# EAGLE design 7-seg_x_8-digRev2 (EAGLE 6.6.0)
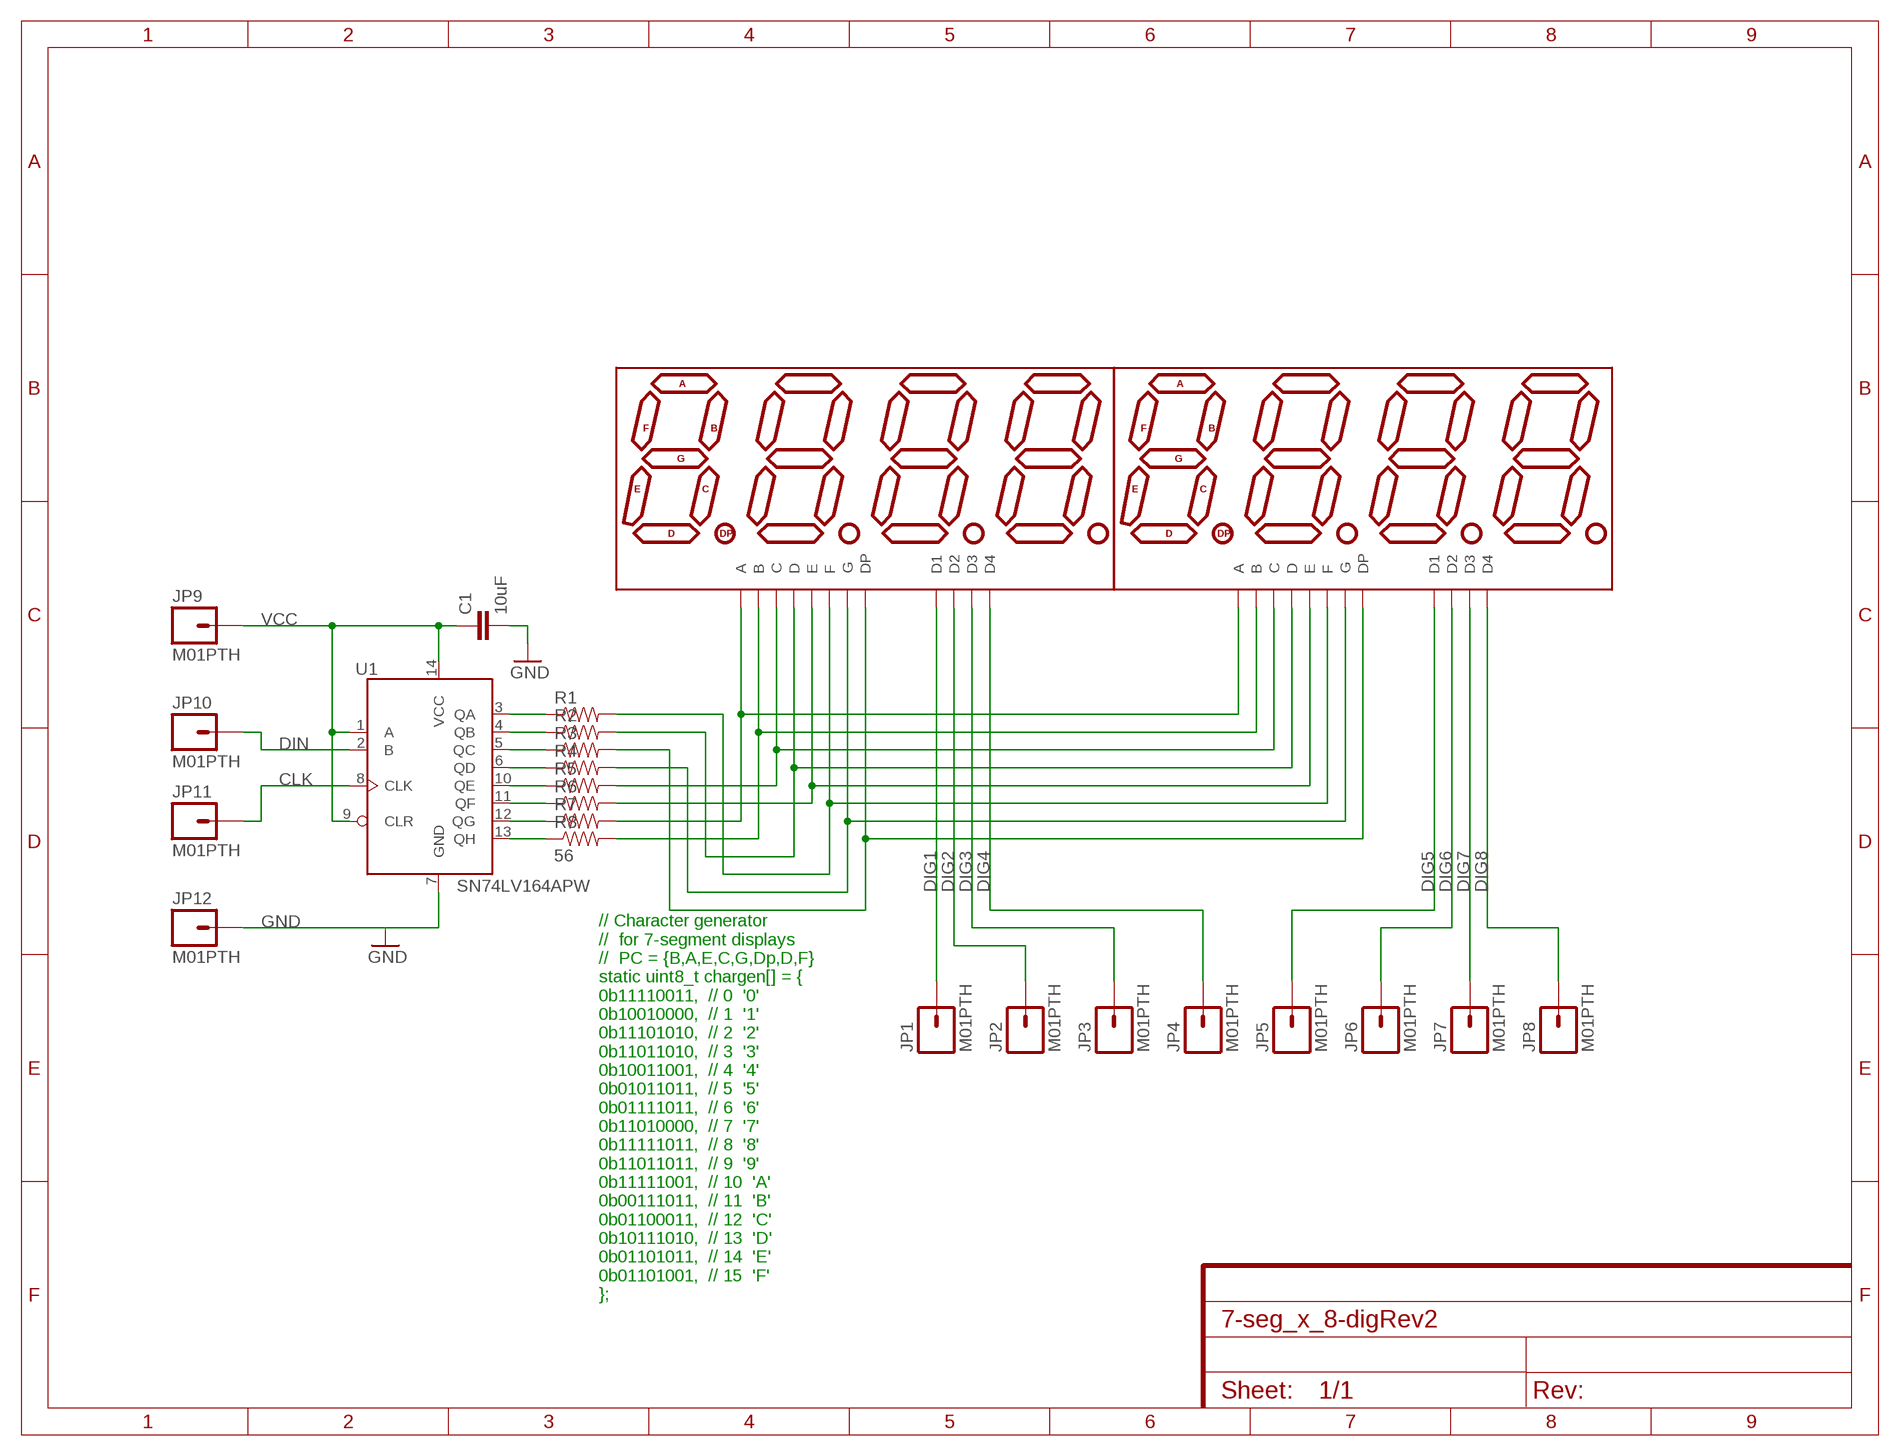
[diagram p0: schematic, sheet 1]

## Parts
C1  10uF  CAP0805  [0805]
FRAME1  FRAME_LTR_CU_MARK  [FR-LTR-ON-PCB]
JP1  M01PTH  [1X01]
JP2  M01PTH  [1X01]
JP3  M01PTH  [1X01]
JP4  M01PTH  [1X01]
JP5  M01PTH  [1X01]
JP6  M01PTH  [1X01]
JP7  M01PTH  [1X01]
JP8  M01PTH  [1X01]
JP9  M01PTH  [1X01]
JP10  M01PTH  [1X01]
JP11  M01PTH  [1X01]
JP12  M01PTH  [1X01]
R1  RESISTOR0805-RES  [0805]
R2  RESISTOR0805-RES  [0805]
R3  RESISTOR0805-RES  [0805]
R4  RESISTOR0805-RES  [0805]
R5  RESISTOR0805-RES  [0805]
R6  RESISTOR0805-RES  [0805]
R7  RESISTOR0805-RES  [0805]
R8  56  RESISTOR0805-RES  [0805]
U1  SN74LV164APW  [TSSOP-14(TI)]
U$1  HP_DISPLAY  [DIL12]
U$2  HP_DISPLAY  [DIL12]

## Nets
CLK: JP11.1 U1.8(CLK)
DIG1: JP1.1 U$1.1(D1)
DIG2: JP2.1 U$1.10(D2)
DIG3: JP3.1 U$1.4(D3)
DIG4: JP4.1 U$1.6(D4)
DIG5: JP5.1 U$2.1(D1)
DIG6: JP6.1 U$2.10(D2)
DIG7: JP7.1 U$2.4(D3)
DIG8: JP8.1 U$2.6(D4)
DIN: JP10.1 U1.2(B)
GND: C1.2 JP12.1 U1.7(GND)
N$1: R1.1 U1.3(QA)
N$2: R2.1 U1.4(QB)
N$3: R3.1 U1.5(QC)
N$4: R4.1 U1.6(QD)
N$5: R5.1 U1.10(QE)
N$6: R6.1 U1.11(QF)
N$7: R7.1 U1.12(QG)
N$8: R8.1 U1.13(QH)
SEGA: R7.2 U$1.12(A) U$2.12(A)
SEGB: R8.2 U$1.11(B) U$2.11(B)
SEGC: R5.2 U$1.3(C) U$2.3(C)
SEGD: R2.2 U$1.8(D) U$2.8(D)
SEGDP: R3.2 U$1.5(DP) U$2.5(DP)
SEGE: R6.2 U$1.2(E) U$2.2(E)
SEGF: R1.2 U$1.9(F) U$2.9(F)
SEGG: R4.2 U$1.7(G) U$2.7(G)
VCC: C1.1 JP9.1 U1.1(A) U1.9(CLR) U1.14(VCC)

## Notes on the sheet
- // Character generator
  //  for 7-segment displays
  //  PC = {B,A,E,C,G,Dp,D,F}
  static uint8_t chargen[] = {
  0b11110011,  // 0  '0'
  0b10010000,  // 1  '1'
  0b11101010,  // 2  '2'
  0b11011010,  // 3  '3'
  0b10011001,  // 4  '4'
  0b01011011,  // 5  '5'
  0b01111011,  // 6  '6'
  0b11010000,  // 7  '7'
  0b11111011,  // 8  '8'
  0b11011011,  // 9  '9'
  0b11111001,  // 10  'A'
  0b00111011,  // 11  'B'
  0b01100011,  // 12  'C'
  0b10111010,  // 13  'D'
  0b01101011,  // 14  'E'
  0b01101001,  // 15  'F'
  };

## Library data of the parts
C1 = SparkFun-Capacitors:CAP: Capacitor Standard 0603 ceramic capacitor, and 0.1" leaded capacitor.
FRAME1 = NewFrame:FRAME_LTR_CU_MARK: This frame is sized for an 8.5x11" page with a 0.25" margin. It also places a name, datecode and revision mark in the bottom copper layer of the PCB.; CNAME: C.Schnarel; CREVISION: Rev 2; DATECODE: 13OCT2014; DESIGNER: C.Schnarel
JP1-JP12 = SparkFun-Connectors:M01: Header 1 Standard 1-pin 0.1" header. Use with straight break away headers (SKU : PRT-00116), right angle break away headers (PRT-00553), swiss pins (PRT-00743), machine pins (PRT-00117), and female headers (PRT-00115).
R1-R8 = SparkFun-Resistors:RESISTOR: Resistor Basic schematic elements and footprints for 0603, 1206, and PTH resistors.
U1 = ChipsParts:SN74LV164A: 8-BIT SERIAL-IN PARALLEL-OUT SHIFT REGISTER with clear
U$1 U$2 = playground:HP_DISPLAY

## Board
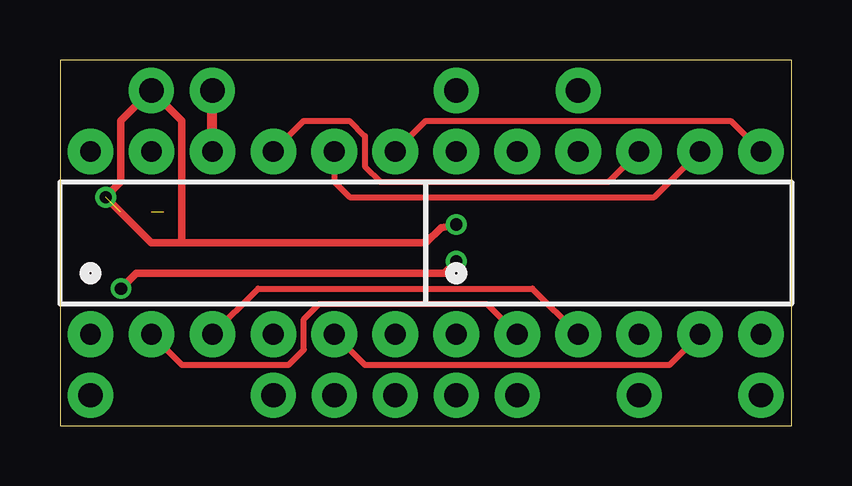
[diagram p1: board, top side]
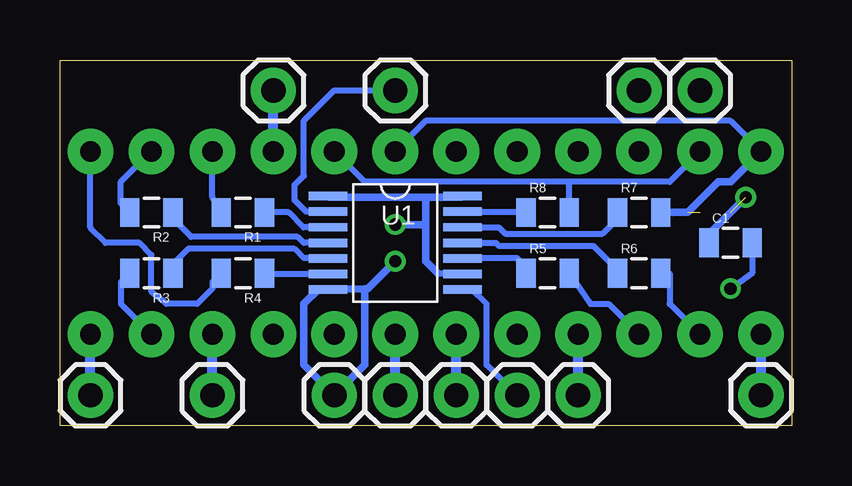
[diagram p2: board, bottom side, seen from below]

Size 30.48 x 15.24 mm. Coordinates in mm from the lower left corner, seen from the top.
Outline: 0,0 30.48,0 30.48,15.24 0,15.24 0,0
Copper layers (1*16): Top 0.0356mm / dielectric 1.5011mm / Bottom 0.0356mm
Design rules "LaenPCBOrder": minimum track width 6mil, minimum drill 13mil, track to track 6mil, track to pad 6mil, pad to pad 6mil, via to via 6mil, smd to smd 6mil, copper to edge 15mil, drill to drill 6mil, minimum pad ring 7mil, minimum via ring 7mil, stop-mask expansion 4mil, vias tented up to drill 0mil, thermal gap 10mil

### Footprints (pad centres in the part's own frame; a part is rotated, then mirrored left to right if it is on the bottom)
0805 = smd 0.8 x 1.2: 1 -0.9,0; 2 0.9,0
1X01 = drill 1.016 pad 1.88: 1 0,0
TSSOP-14(TI) = smd 1.6 x 0.35: 1 -2.8,1.95; 2 -2.8,1.3; 3 -2.8,0.65; 4 -2.8,0; 5 -2.8,-0.65; 6 -2.8,-1.3; 7 -2.8,-1.95; 8 2.8,-1.95; 9 2.8,-1.3; 10 2.8,-0.65; 11 2.8,0; 12 2.8,0.65; 13 2.8,1.3; 14 2.8,1.95
DIL12 = drill 0.864 pad 1.905: 1 -6.35,-3.81; 2 -3.81,-3.81; 3 -1.27,-3.81; 4 1.27,-3.81; 5 3.81,-3.81; 6 6.35,-3.81; 7 6.35,3.81; 8 3.81,3.81; 9 1.27,3.81; 10 -1.27,3.81; 11 -3.81,3.81; 12 -6.35,3.81

### Placement (x,y rotation side)
C1  2.54,7.62 0 bottom
FRAME1  21.59,5.71 0 bottom
JP1  1.27,1.27 0 bottom
JP2  6.35,13.97 0 bottom
JP3  8.89,1.27 0 bottom
JP4  13.97,1.27 0 bottom
JP5  16.51,1.27 0 bottom
JP6  21.59,13.97 0 bottom
JP7  24.13,1.27 0 bottom
JP8  29.21,1.27 0 bottom
JP9  3.81,13.97 0 bottom
JP10  16.51,13.97 0 bottom
JP11  11.43,1.27 0 bottom
JP12  19.05,1.27 0 bottom
R1  22.86,8.89 180 bottom
R2  26.67,8.89 180 bottom
R3  26.67,6.35 180 bottom
R4  22.86,6.35 180 bottom
R5  10.16,6.35 0 bottom
R6  6.35,6.35 0 bottom
R7  6.35,8.89 0 bottom
R8  10.16,8.89 0 bottom
U1  16.51,7.62 0 bottom
U$1  7.62,7.62 0 top
U$2  22.86,7.62 0 top

### Tracks (layer width: path | path; a pad name or v marks a point on that pad's centre or on a via)
CLK
  Bottom 0.152: 13.97,5.71 U1.8
  Bottom 0.254: JP11.1 12.7,2.54 12.7,5.08 13.34,5.71 13.97,5.71
DIG1
  Bottom 0.406: JP1.1 U$1.1
DIG2
  Top 0.406: U$1.10 JP2.1
DIG3
  Bottom 0.406: JP3.1 U$1.4
DIG4
  Bottom 0.406: JP4.1 U$1.6
DIG5
  Bottom 0.406: JP5.1 U$2.1
DIG6
  Bottom 0.406: U$2.10 JP6.1
DIG7
  Bottom 0.406: JP7.1 U$2.4
DIG8
  Bottom 0.406: JP8.1 U$2.6
DIN
  Bottom 0.254: JP10.1 19.05,13.97 20.32,12.7 20.32,10.41 20.7,10.03 20.7,9.4 20.22,8.92 U1.2
GND  (via drill 0.51)
  Top 0.305: v16.51,6.86 16,6.35 3.17,6.35 v2.54,5.71
  Bottom 0.254: U1.7 19.73,5.67 | C1.2 1.64,6.36 v2.54,5.71
  Bottom 0.305: 17.78,5.71 17.78,2.54 JP12.1 20.32,2.54 20.32,5.08 19.73,5.67 | 17.78,5.71 U1.7 | 17.78,5.71 17.65,5.71 v16.51,6.86
N$1
  Bottom 0.254: R1.1 20.95,8.89 20.34,8.27 U1.3
N$2
  Bottom 0.152: 25.77,8.62 R2.1
  Bottom 0.254: U1.4 20.32,7.62 20.57,7.87 25.02,7.87 25.77,8.62
N$3
  Bottom 0.152: U1.5 19.32,6.99 | 25.77,6.74 R3.1
  Bottom 0.254: 19.32,6.99 20.32,6.99 20.7,7.37 25.15,7.37 25.77,6.74
N$4
  Bottom 0.254: U1.6 21.93,6.32 R4.1
N$5
  Bottom 0.152: R5.1 11.06,6.62 | 13.7,6.99 U1.10
  Bottom 0.254: 11.06,6.62 11.43,6.99 13.7,6.99
N$6
  Bottom 0.152: 7.49,6.73 7.49,6.59 R6.1
  Bottom 0.254: U1.11 12.32,7.62 12.19,7.49 8.27,7.49 7.49,6.73
N$7
  Bottom 0.152: 7.25,8.62 R7.1
  Bottom 0.254: U1.12 12.21,8.27 11.94,8 7.87,8 7.25,8.62
N$8
  Bottom 0.152: 11.09,8.92 R8.1
  Bottom 0.254: U1.13 11.09,8.92
SEGA  (1 unrouted)
  Bottom 0.254: U$1.12 2.54,12.7 15.24,12.7 U$2.12
  Bottom 0.305: R7.2 4.32,8.89 3.05,10.16 2.54,10.16 U$1.12
SEGB
  Bottom 0.152: R8.2 9.27,8.9
  Bottom 0.254: U$1.11 5.08,10.16 9.27,10.16 | 9.27,10.16 17.78,10.16 U$2.11 | 9.27,8.9 9.27,10.16
SEGC
  Top 0.254: U$1.3 8.26,5.71 19.68,5.71 U$2.3
  Bottom 0.254: R5.2 8.38,5.08 7.62,5.08 U$1.3
SEGD
  Top 0.254: U$1.8 11.43,10.16 12.06,9.53 24.77,9.53 U$2.8
  Bottom 0.152: R2.2 27.94,9.26
  Bottom 0.254: 27.94,9.26 27.94,10.16 U$2.8
SEGDP
  Top 0.254: U$1.5 12.7,2.54 25.4,2.54 U$2.5
  Bottom 0.254: U$2.5 27.94,5.08 27.94,5.98 R3.2
SEGE
  Top 0.254: U$1.2 5.08,2.54 9.53,2.54 10.16,3.17 10.16,4.45 10.79,5.08 17.78,5.08 U$2.2
  Bottom 0.254: R6.2 5.08,6.35 5.08,5.08 U$1.2
SEGF
  Top 0.254: U$1.9 10.16,12.7 12.06,12.7 12.7,12.06 12.7,10.79 13.34,10.16 22.86,10.16 U$2.9
  Bottom 0.254: R1.2 24.13,9.53 U$2.9
SEGG
  Top 0.254: U$1.7 15.24,12.7 27.94,12.7 U$2.7
  Bottom 0.254: U$2.7 29.21,8.26 28.57,7.62 27.18,7.62 26.67,7.11 26.67,5.59 26.04,5.08 24.77,5.08 24.13,5.71 24.13,5.98 R4.2
VCC  (via drill 0.51)  (1 unrouted)
  Top 0.305: v16.51,8.38 15.88,8.26 15.24,7.62 5.08,7.62 | 5.08,7.62 5.08,12.7 JP9.1 2.54,12.7 2.54,10.16 v1.91,9.53 2.54,8.89 3.81,7.62 4.45,7.62 5.08,7.62
  Bottom 0.152: U1.14 13.76,9.53 | 13.74,6.35 U1.9 | 19.27,9.53 U1.1
  Bottom 0.254: 14.73,6.35 13.74,6.35
  Bottom 0.305: 15.24,9.53 15.24,8.38 | 15.24,8.38 15.24,6.86 14.73,6.35 | 13.76,9.53 15.24,9.53 | 15.24,9.53 19.27,9.53 | 15.24,8.38 v16.51,8.38 | C1.1 3.44,7.99 v1.91,9.53

### Text on the board
tDocu: VCC | D2 | DIN | D6 | D1 | D3 | CLK | D4 | D5 | GND | D7 | D8